# Altium schematic sheet PL_DDR.SchDoc: PL_DDR
size A4 portrait; Author: Carlos Barreiro; Organization: Escuela Técnica Superior de Ingeniería de Sistemas Informáticos de la Universidad Politécnica de Madrid; Address1: Campus Sur de la Universidad Politécnica de Madrid; Address2: Calle de Alan Turing, s/nº; Address3: Madrid 28031; Address4: España; DocumentNumber: 4; Revision: A; SheetNumber: 4; SheetTotal: 16
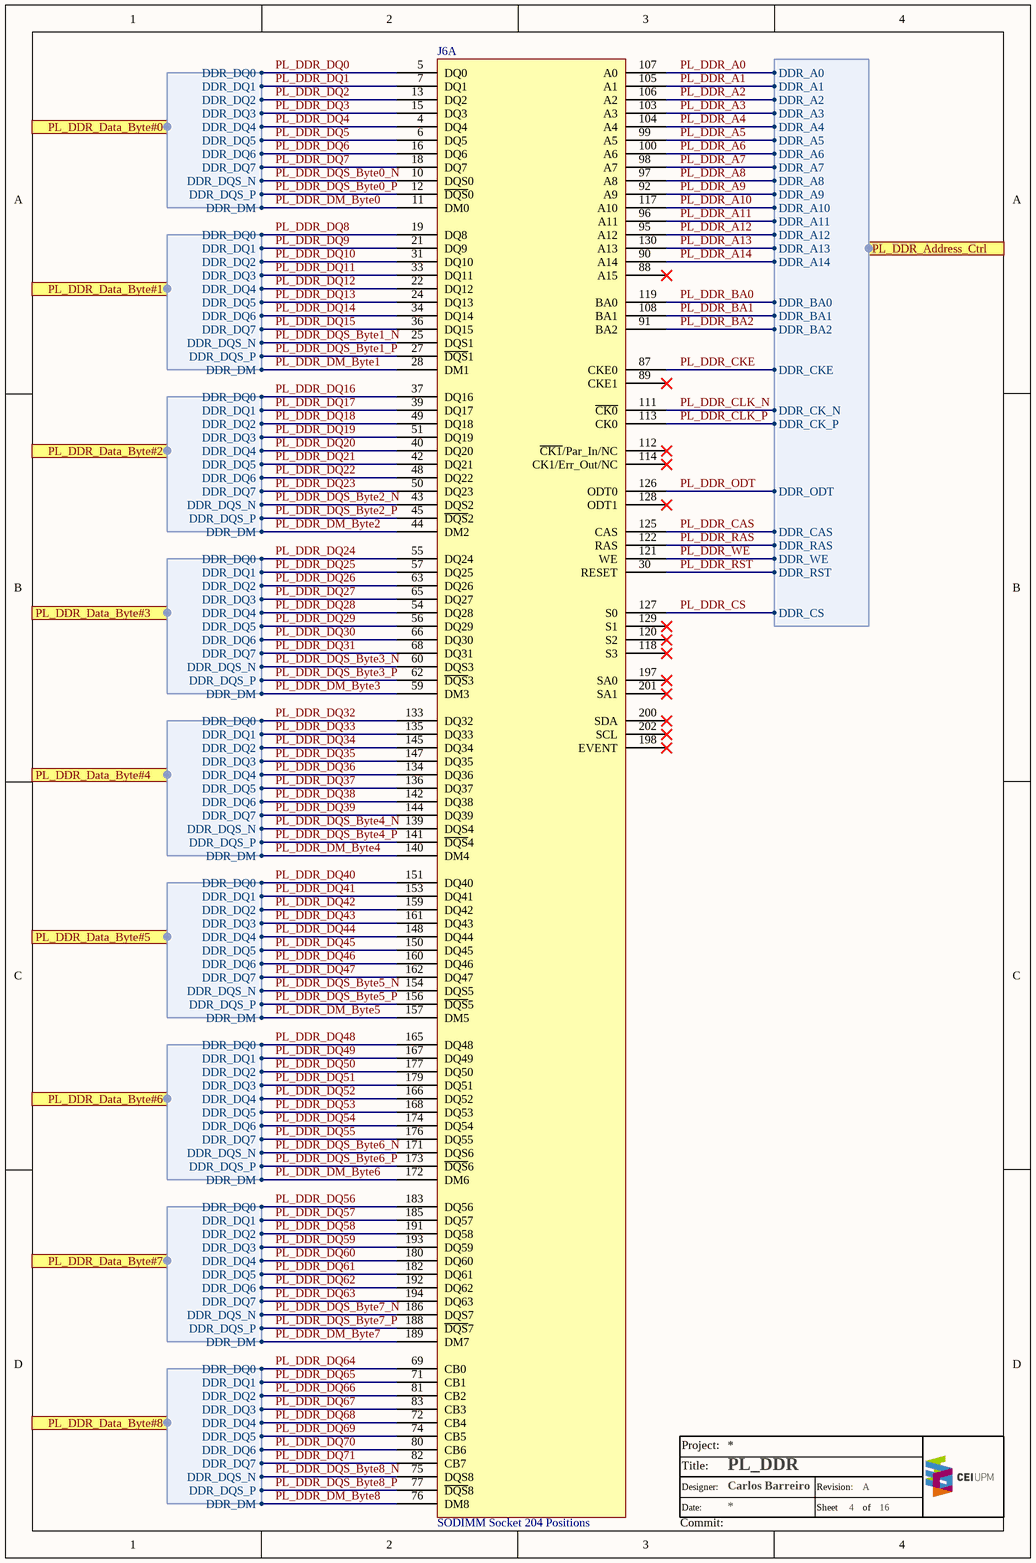
[diagram p0: PL_DDR.SchDoc]

## Parts
J6  SODIMM Socket 204 Positions  [TE_DDR3_SODIMM_RA_Socket]  (part A of 2)

## Ports
PL_DDR_Address_Ctrl (harness DDR_Address_Ctrl), PL_DDR_Data_Byte#0 (harness DDR_Data_Byte), PL_DDR_Data_Byte#1 (harness DDR_Data_Byte), PL_DDR_Data_Byte#2 (harness DDR_Data_Byte), PL_DDR_Data_Byte#3 (harness DDR_Data_Byte), PL_DDR_Data_Byte#4 (in, harness DDR_Data_Byte), PL_DDR_Data_Byte#5 (harness DDR_Data_Byte), PL_DDR_Data_Byte#6 (in, harness DDR_Data_Byte), PL_DDR_Data_Byte#7 (in, harness DDR_Data_Byte), PL_DDR_Data_Byte#8 (in, harness DDR_Data_Byte)

## Harnesses
DDR_Data_Byte: DDR_DM, DDR_DQ0, DDR_DQ1, DDR_DQ2, DDR_DQ3, DDR_DQ4, DDR_DQ5, DDR_DQ6, DDR_DQ7, DDR_DQS_N, DDR_DQS_P
DDR_Address_Ctrl: DDR_A0, DDR_A1, DDR_A10, DDR_A11, DDR_A12, DDR_A13, DDR_A14, DDR_A2, DDR_A3, DDR_A4, DDR_A5, DDR_A6, DDR_A7, DDR_A8, DDR_A9, DDR_BA0, DDR_BA1, DDR_BA2, DDR_CAS, DDR_CK_N, DDR_CK_P, DDR_CKE, DDR_CS, DDR_ODT, DDR_RAS, DDR_RST, DDR_WE

## Nets
PL_DDR_A0: J6.107(A0) ; port PL_DDR_Address_Ctrl.DDR_A0
PL_DDR_A1: J6.105(A1) ; port PL_DDR_Address_Ctrl.DDR_A1
PL_DDR_A2: J6.106(A2) ; port PL_DDR_Address_Ctrl.DDR_A2
PL_DDR_A3: J6.103(A3) ; port PL_DDR_Address_Ctrl.DDR_A3
PL_DDR_A4: J6.104(A4) ; port PL_DDR_Address_Ctrl.DDR_A4
PL_DDR_A5: J6.99(A5) ; port PL_DDR_Address_Ctrl.DDR_A5
PL_DDR_A6: J6.100(A6) ; port PL_DDR_Address_Ctrl.DDR_A6
PL_DDR_A7: J6.98(A7) ; port PL_DDR_Address_Ctrl.DDR_A7
PL_DDR_A8: J6.97(A8) ; port PL_DDR_Address_Ctrl.DDR_A8
PL_DDR_A9: J6.92(A9) ; port PL_DDR_Address_Ctrl.DDR_A9
PL_DDR_A10: J6.117(A10) ; port PL_DDR_Address_Ctrl.DDR_A10
PL_DDR_A11: J6.96(A11) ; port PL_DDR_Address_Ctrl.DDR_A11
PL_DDR_A12: J6.95(A12) ; port PL_DDR_Address_Ctrl.DDR_A12
PL_DDR_A13: J6.130(A13) ; port PL_DDR_Address_Ctrl.DDR_A13
PL_DDR_A14: J6.90(A14) ; port PL_DDR_Address_Ctrl.DDR_A14
PL_DDR_BA0: J6.119(BA0) ; port PL_DDR_Address_Ctrl.DDR_BA0
PL_DDR_BA1: J6.108(BA1) ; port PL_DDR_Address_Ctrl.DDR_BA1
PL_DDR_BA2: J6.91(BA2) ; port PL_DDR_Address_Ctrl.DDR_BA2
PL_DDR_CAS: J6.125(CAS) ; port PL_DDR_Address_Ctrl.DDR_CAS
PL_DDR_CKE: J6.87(CKE0) ; port PL_DDR_Address_Ctrl.DDR_CKE
PL_DDR_CLK_N: J6.111(~{CK0}) ; port PL_DDR_Address_Ctrl.DDR_CK_N
PL_DDR_CLK_P: J6.113(CK0) ; port PL_DDR_Address_Ctrl.DDR_CK_P
PL_DDR_CS: J6.127(S0) ; port PL_DDR_Address_Ctrl.DDR_CS
PL_DDR_DM_Byte0: J6.11(DM0) ; port PL_DDR_Data_Byte#0.DDR_DM
PL_DDR_DM_Byte1: J6.28(DM1) ; port PL_DDR_Data_Byte#1.DDR_DM
PL_DDR_DM_Byte2: J6.44(DM2) ; port PL_DDR_Data_Byte#2.DDR_DM
PL_DDR_DM_Byte3: J6.59(DM3) ; port PL_DDR_Data_Byte#3.DDR_DM
PL_DDR_DM_Byte4: J6.140(DM4) ; port PL_DDR_Data_Byte#4.DDR_DM
PL_DDR_DM_Byte5: J6.157(DM5) ; port PL_DDR_Data_Byte#5.DDR_DM
PL_DDR_DM_Byte6: J6.172(DM6) ; port PL_DDR_Data_Byte#6.DDR_DM
PL_DDR_DM_Byte7: J6.189(DM7) ; port PL_DDR_Data_Byte#7.DDR_DM
PL_DDR_DM_Byte8: J6.76(DM8) ; port PL_DDR_Data_Byte#8.DDR_DM
PL_DDR_DQ0: J6.5(DQ0) ; port PL_DDR_Data_Byte#0.DDR_DQ0
PL_DDR_DQ1: J6.7(DQ1) ; port PL_DDR_Data_Byte#0.DDR_DQ1
PL_DDR_DQ2: J6.13(DQ2) ; port PL_DDR_Data_Byte#0.DDR_DQ2
PL_DDR_DQ3: J6.15(DQ3) ; port PL_DDR_Data_Byte#0.DDR_DQ3
PL_DDR_DQ4: J6.4(DQ4) ; port PL_DDR_Data_Byte#0.DDR_DQ4
PL_DDR_DQ5: J6.6(DQ5) ; port PL_DDR_Data_Byte#0.DDR_DQ5
PL_DDR_DQ6: J6.16(DQ6) ; port PL_DDR_Data_Byte#0.DDR_DQ6
PL_DDR_DQ7: J6.18(DQ7) ; port PL_DDR_Data_Byte#0.DDR_DQ7
PL_DDR_DQ8: J6.19(DQ8) ; port PL_DDR_Data_Byte#1.DDR_DQ0
PL_DDR_DQ9: J6.21(DQ9) ; port PL_DDR_Data_Byte#1.DDR_DQ1
PL_DDR_DQ10: J6.31(DQ10) ; port PL_DDR_Data_Byte#1.DDR_DQ2
PL_DDR_DQ11: J6.33(DQ11) ; port PL_DDR_Data_Byte#1.DDR_DQ3
PL_DDR_DQ12: J6.22(DQ12) ; port PL_DDR_Data_Byte#1.DDR_DQ4
PL_DDR_DQ13: J6.24(DQ13) ; port PL_DDR_Data_Byte#1.DDR_DQ5
PL_DDR_DQ14: J6.34(DQ14) ; port PL_DDR_Data_Byte#1.DDR_DQ6
PL_DDR_DQ15: J6.36(DQ15) ; port PL_DDR_Data_Byte#1.DDR_DQ7
PL_DDR_DQ16: J6.37(DQ16) ; port PL_DDR_Data_Byte#2.DDR_DQ0
PL_DDR_DQ17: J6.39(DQ17) ; port PL_DDR_Data_Byte#2.DDR_DQ1
PL_DDR_DQ18: J6.49(DQ18) ; port PL_DDR_Data_Byte#2.DDR_DQ2
PL_DDR_DQ19: J6.51(DQ19) ; port PL_DDR_Data_Byte#2.DDR_DQ3
PL_DDR_DQ20: J6.40(DQ20) ; port PL_DDR_Data_Byte#2.DDR_DQ4
PL_DDR_DQ21: J6.42(DQ21) ; port PL_DDR_Data_Byte#2.DDR_DQ5
PL_DDR_DQ22: J6.48(DQ22) ; port PL_DDR_Data_Byte#2.DDR_DQ6
PL_DDR_DQ23: J6.50(DQ23) ; port PL_DDR_Data_Byte#2.DDR_DQ7
PL_DDR_DQ24: J6.55(DQ24) ; port PL_DDR_Data_Byte#3.DDR_DQ0
PL_DDR_DQ25: J6.57(DQ25) ; port PL_DDR_Data_Byte#3.DDR_DQ1
PL_DDR_DQ26: J6.63(DQ26) ; port PL_DDR_Data_Byte#3.DDR_DQ2
PL_DDR_DQ27: J6.65(DQ27) ; port PL_DDR_Data_Byte#3.DDR_DQ3
PL_DDR_DQ28: J6.54(DQ28) ; port PL_DDR_Data_Byte#3.DDR_DQ4
PL_DDR_DQ29: J6.56(DQ29) ; port PL_DDR_Data_Byte#3.DDR_DQ5
PL_DDR_DQ30: J6.66(DQ30) ; port PL_DDR_Data_Byte#3.DDR_DQ6
PL_DDR_DQ31: J6.68(DQ31) ; port PL_DDR_Data_Byte#3.DDR_DQ7
PL_DDR_DQ32: J6.133(DQ32) ; port PL_DDR_Data_Byte#4.DDR_DQ0
PL_DDR_DQ33: J6.135(DQ33) ; port PL_DDR_Data_Byte#4.DDR_DQ1
PL_DDR_DQ34: J6.145(DQ34) ; port PL_DDR_Data_Byte#4.DDR_DQ2
PL_DDR_DQ35: J6.147(DQ35) ; port PL_DDR_Data_Byte#4.DDR_DQ3
PL_DDR_DQ36: J6.134(DQ36) ; port PL_DDR_Data_Byte#4.DDR_DQ4
PL_DDR_DQ37: J6.136(DQ37) ; port PL_DDR_Data_Byte#4.DDR_DQ5
PL_DDR_DQ38: J6.142(DQ38) ; port PL_DDR_Data_Byte#4.DDR_DQ6
PL_DDR_DQ39: J6.144(DQ39) ; port PL_DDR_Data_Byte#4.DDR_DQ7
PL_DDR_DQ40: J6.151(DQ40) ; port PL_DDR_Data_Byte#5.DDR_DQ0
PL_DDR_DQ41: J6.153(DQ41) ; port PL_DDR_Data_Byte#5.DDR_DQ1
PL_DDR_DQ42: J6.159(DQ42) ; port PL_DDR_Data_Byte#5.DDR_DQ2
PL_DDR_DQ43: J6.161(DQ43) ; port PL_DDR_Data_Byte#5.DDR_DQ3
PL_DDR_DQ44: J6.148(DQ44) ; port PL_DDR_Data_Byte#5.DDR_DQ4
PL_DDR_DQ45: J6.150(DQ45) ; port PL_DDR_Data_Byte#5.DDR_DQ5
PL_DDR_DQ46: J6.160(DQ46) ; port PL_DDR_Data_Byte#5.DDR_DQ6
PL_DDR_DQ47: J6.162(DQ47) ; port PL_DDR_Data_Byte#5.DDR_DQ7
PL_DDR_DQ48: J6.165(DQ48) ; port PL_DDR_Data_Byte#6.DDR_DQ0
PL_DDR_DQ49: J6.167(DQ49) ; port PL_DDR_Data_Byte#6.DDR_DQ1
PL_DDR_DQ50: J6.177(DQ50) ; port PL_DDR_Data_Byte#6.DDR_DQ2
PL_DDR_DQ51: J6.179(DQ51) ; port PL_DDR_Data_Byte#6.DDR_DQ3
PL_DDR_DQ52: J6.166(DQ52) ; port PL_DDR_Data_Byte#6.DDR_DQ4
PL_DDR_DQ53: J6.168(DQ53) ; port PL_DDR_Data_Byte#6.DDR_DQ5
PL_DDR_DQ54: J6.174(DQ54) ; port PL_DDR_Data_Byte#6.DDR_DQ6
PL_DDR_DQ55: J6.176(DQ55) ; port PL_DDR_Data_Byte#6.DDR_DQ7
PL_DDR_DQ56: J6.183(DQ56) ; port PL_DDR_Data_Byte#7.DDR_DQ0
PL_DDR_DQ57: J6.185(DQ57) ; port PL_DDR_Data_Byte#7.DDR_DQ1
PL_DDR_DQ58: J6.191(DQ58) ; port PL_DDR_Data_Byte#7.DDR_DQ2
PL_DDR_DQ59: J6.193(DQ59) ; port PL_DDR_Data_Byte#7.DDR_DQ3
PL_DDR_DQ60: J6.180(DQ60) ; port PL_DDR_Data_Byte#7.DDR_DQ4
PL_DDR_DQ61: J6.182(DQ61) ; port PL_DDR_Data_Byte#7.DDR_DQ5
PL_DDR_DQ62: J6.192(DQ62) ; port PL_DDR_Data_Byte#7.DDR_DQ6
PL_DDR_DQ63: J6.194(DQ63) ; port PL_DDR_Data_Byte#7.DDR_DQ7
PL_DDR_DQ64: J6.69(CB0) ; port PL_DDR_Data_Byte#8.DDR_DQ0
PL_DDR_DQ65: J6.71(CB1) ; port PL_DDR_Data_Byte#8.DDR_DQ1
PL_DDR_DQ66: J6.81(CB2) ; port PL_DDR_Data_Byte#8.DDR_DQ2
PL_DDR_DQ67: J6.83(CB3) ; port PL_DDR_Data_Byte#8.DDR_DQ3
PL_DDR_DQ68: J6.72(CB4) ; port PL_DDR_Data_Byte#8.DDR_DQ4
PL_DDR_DQ69: J6.74(CB5) ; port PL_DDR_Data_Byte#8.DDR_DQ5
PL_DDR_DQ70: J6.80(CB6) ; port PL_DDR_Data_Byte#8.DDR_DQ6
PL_DDR_DQ71: J6.82(CB7) ; port PL_DDR_Data_Byte#8.DDR_DQ7
PL_DDR_DQS_Byte0_N: J6.10(DQS0) ; port PL_DDR_Data_Byte#0.DDR_DQS_N
PL_DDR_DQS_Byte0_P: J6.12(~{DQS}0) ; port PL_DDR_Data_Byte#0.DDR_DQS_P
PL_DDR_DQS_Byte1_N: J6.25(DQS1) ; port PL_DDR_Data_Byte#1.DDR_DQS_N
PL_DDR_DQS_Byte1_P: J6.27(~{DQS}1) ; port PL_DDR_Data_Byte#1.DDR_DQS_P
PL_DDR_DQS_Byte2_N: J6.43(DQS2) ; port PL_DDR_Data_Byte#2.DDR_DQS_N
PL_DDR_DQS_Byte2_P: J6.45(~{DQS}2) ; port PL_DDR_Data_Byte#2.DDR_DQS_P
PL_DDR_DQS_Byte3_N: J6.60(DQS3) ; port PL_DDR_Data_Byte#3.DDR_DQS_N
PL_DDR_DQS_Byte3_P: J6.62(~{DQS}3) ; port PL_DDR_Data_Byte#3.DDR_DQS_P
PL_DDR_DQS_Byte4_N: J6.139(DQS4) ; port PL_DDR_Data_Byte#4.DDR_DQS_N
PL_DDR_DQS_Byte4_P: J6.141(~{DQS}4) ; port PL_DDR_Data_Byte#4.DDR_DQS_P
PL_DDR_DQS_Byte5_N: J6.154(DQS5) ; port PL_DDR_Data_Byte#5.DDR_DQS_N
PL_DDR_DQS_Byte5_P: J6.156(~{DQS}5) ; port PL_DDR_Data_Byte#5.DDR_DQS_P
PL_DDR_DQS_Byte6_N: J6.171(DQS6) ; port PL_DDR_Data_Byte#6.DDR_DQS_N
PL_DDR_DQS_Byte6_P: J6.173(~{DQS}6) ; port PL_DDR_Data_Byte#6.DDR_DQS_P
PL_DDR_DQS_Byte7_N: J6.186(DQS7) ; port PL_DDR_Data_Byte#7.DDR_DQS_N
PL_DDR_DQS_Byte7_P: J6.188(~{DQS}7) ; port PL_DDR_Data_Byte#7.DDR_DQS_P
PL_DDR_DQS_Byte8_N: J6.75(DQS8) ; port PL_DDR_Data_Byte#8.DDR_DQS_N
PL_DDR_DQS_Byte8_P: J6.77(~{DQS}8) ; port PL_DDR_Data_Byte#8.DDR_DQS_P
PL_DDR_ODT: J6.126(ODT0) ; port PL_DDR_Address_Ctrl.DDR_ODT
PL_DDR_RAS: J6.122(RAS) ; port PL_DDR_Address_Ctrl.DDR_RAS
PL_DDR_RST: J6.30(RESET) ; port PL_DDR_Address_Ctrl.DDR_RST
PL_DDR_WE: J6.121(WE) ; port PL_DDR_Address_Ctrl.DDR_WE

Not connected (* = marked no-connect by the designer): J6 88(A15)* 89(CKE1)* 112(~{CK1}/Par_In/NC)* 114(CK1/Err_Out/NC)* 118(S3)* 120(S2)* 128(ODT1)* 129(S1)* 197(SA0)* 198(EVENT)* 200(SDA)* 201(SA1)* 202(SCL)*

## Notes on the sheet
- Project:
- Title:
- Date:
- Designer:
- Sheet
- Revision:
- of
- Commit:

## Library data of the parts
J6 = 2-2013310-1: Connector SODIMM Socket 204 Positions, Right Angle, DDR3/DDR3L +1.5V +1.35V; Memory Type: DDR3, DDR3L, SDRAM; Number of Positions: 204; JEDEC Standard: 204-Pin EP3-6400/EP3-8500/EP3-10600/EP3-12800 DDR3 SDRAM 72b-S0-DIMM Design Specification; Number of Rows: 2; Orientation: Right Angle; Packaging: Tape & Reel (TR); Termination: Solder; Radiation Hardening: No; Form Factor: SODIMM; ComponentLink1Description: Manufacturer; ComponentLink1URL: https://www.te.com/usa-en/product-2-2013310-1.html?te_bu=Cor&te_type=other&te_campaign=oct_glo_manufacturer&elqCampaignId=26136; ComponentLink2Description: Pinout; ComponentLink2URL: https://media-www.micron.com/-/media/client/global/documents/products/data-sheet/modules/sodimm/jtf16c256_512_1gx64hz.pdf?rev=92a9360308b84bd182ce55b117fec160; Supplier 1: RSComponents; Supplier 2: Mouser; Supplier 3: Digi-Key; Supplier Part Number 1: 9097429; Supplier Part Number 2: 571-2-2013310-1; Supplier Part Number 3: A111121CT-ND